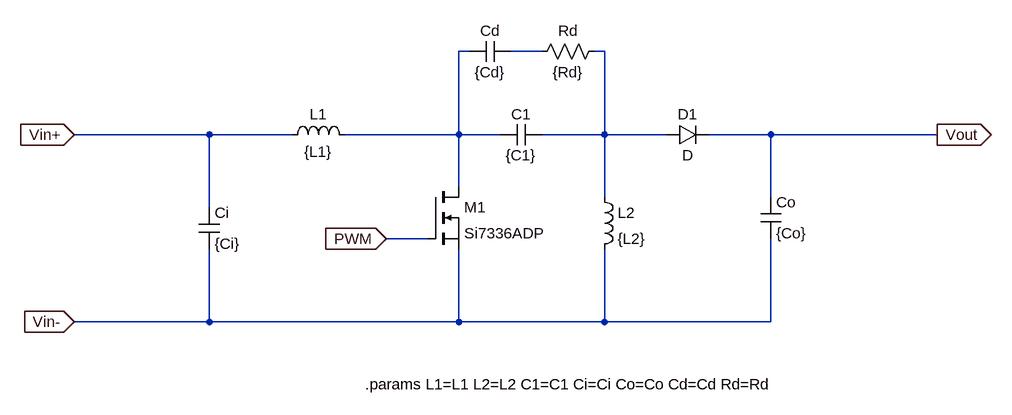
[diagram p0: schematic sepicR2.asc]
sepicR2.asc, the LTspice schematic file:
Version 4
SHEET 1 1508 680
WIRE 240 -64 224 -64
WIRE 352 -64 304 -64
WIRE 448 -64 432 -64
WIRE -160 64 -368 64
WIRE -32 64 -160 64
WIRE 224 64 224 -64
WIRE 224 64 48 64
WIRE 288 64 224 64
WIRE 448 64 448 -64
WIRE 448 64 352 64
WIRE 544 64 448 64
WIRE 704 64 608 64
WIRE 960 64 704 64
WIRE 224 144 224 64
WIRE 448 160 448 64
WIRE 704 160 704 64
WIRE -160 176 -160 64
WIRE 176 224 112 224
WIRE -160 352 -160 240
WIRE -160 352 -368 352
WIRE 224 352 224 240
WIRE 224 352 -160 352
WIRE 448 352 448 240
WIRE 448 352 224 352
WIRE 704 352 704 224
WIRE 704 352 448 352
FLAG -368 64 Vin+
IOPIN -368 64 In
FLAG 112 224 PWM
IOPIN 112 224 In
FLAG 960 64 Vout
IOPIN 960 64 Out
FLAG -368 352 Vin-
IOPIN -368 352 In
SYMBOL cap -176 176 R0
SYMATTR InstName Ci
SYMATTR Value {Ci}
SYMBOL nmos 176 144 R0
SYMATTR InstName M1
SYMATTR Value Si7336ADP
SYMBOL ind 432 144 R0
SYMATTR InstName L2
SYMATTR Value {L2}
SYMBOL cap 688 160 R0
SYMATTR InstName Co
SYMATTR Value {Co}
SYMBOL diode 544 80 R270
WINDOW 0 32 32 VTop 2
WINDOW 3 0 32 VBottom 2
SYMATTR InstName D1
SYMBOL ind -48 80 R270
WINDOW 0 32 56 VTop 2
WINDOW 3 5 56 VBottom 2
SYMATTR InstName L1
SYMATTR Value {L1}
SYMBOL cap 352 48 R90
WINDOW 0 0 32 VBottom 2
WINDOW 3 32 32 VTop 2
SYMATTR InstName C1
SYMATTR Value {C1}
SYMBOL cap 304 -80 R90
WINDOW 0 0 32 VBottom 2
WINDOW 3 32 32 VTop 2
SYMATTR InstName Cd
SYMATTR Value {Cd}
SYMBOL res 448 -80 R90
WINDOW 0 0 56 VBottom 2
WINDOW 3 32 56 VTop 2
SYMATTR InstName Rd
SYMATTR Value {Rd}
TEXT 80 448 Left 2 !.params L1=L1 L2=L2 C1=C1 Ci=Ci Co=Co Cd=Cd Rd=Rd

The netlist it stands for:
* sepicR2.asc
Ci Vin+ Vin- {Ci}
M1 N001 PWM Vin- Vin- Si7336ADP
L2 N003 Vin- {L2}
Co Vout Vin- {Co}
D1 N003 Vout D
L1 Vin+ N001 {L1}
C1 N003 N001 {C1}
Cd N002 N001 {Cd}
Rd N003 N002 {Rd}
.model D D
.lib standard.dio
.model NMOS NMOS
.model PMOS PMOS
.lib standard.mos
.params L1=L1 L2=L2 C1=C1 Ci=Ci Co=Co Cd=Cd Rd=Rd
.backanno
.end